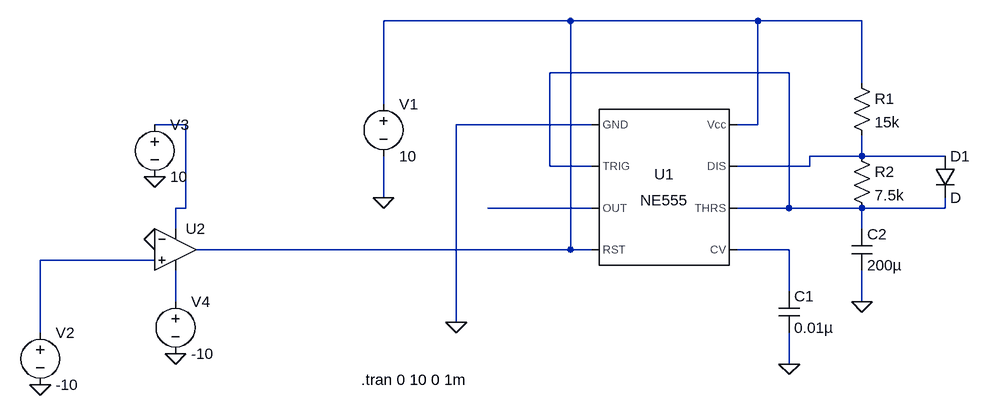
[diagram p0: schematic progetto.asc]
progetto.asc, the LTspice schematic file:
Version 4
SHEET 1 880 680
WIRE 144 -208 -144 -208
WIRE 432 -208 144 -208
WIRE 592 -208 432 -208
WIRE 480 -128 112 -128
WIRE 592 -112 592 -208
WIRE -144 -80 -144 -208
WIRE -448 -48 -496 -48
WIRE 176 -48 -32 -48
WIRE 432 -48 432 -208
WIRE 432 -48 400 -48
WIRE 592 0 592 -32
WIRE 592 0 512 0
WIRE 720 0 592 0
WIRE 112 16 112 -128
WIRE 176 16 112 16
WIRE 512 16 512 0
WIRE 512 16 400 16
WIRE -144 64 -144 0
WIRE -448 80 -448 -48
WIRE -448 80 -464 80
WIRE 176 80 16 80
WIRE 480 80 480 -128
WIRE 480 80 400 80
WIRE 592 80 480 80
WIRE 720 80 720 64
WIRE 720 80 592 80
WIRE -464 112 -464 80
WIRE 592 112 592 80
WIRE 144 144 144 -208
WIRE 144 144 -432 144
WIRE 176 144 144 144
WIRE 480 144 400 144
WIRE -496 160 -672 160
WIRE 480 208 480 144
WIRE -464 224 -464 176
WIRE 592 224 592 176
WIRE -32 256 -32 -48
WIRE -672 272 -672 160
WIRE 480 320 480 272
FLAG -32 256 0
FLAG -144 64 0
FLAG 480 320 0
FLAG 592 224 0
FLAG -496 128 0
FLAG -672 352 0
FLAG -464 304 0
FLAG -496 32 0
SYMBOL Misc\\NE555 288 48 R0
SYMATTR InstName U1
SYMBOL voltage -144 -96 R0
WINDOW 123 0 0 Left 0
WINDOW 39 0 0 Left 0
SYMATTR InstName V1
SYMATTR Value 10
SYMBOL cap 464 208 R0
SYMATTR InstName C1
SYMATTR Value 0.01µ
SYMBOL res 576 -16 R0
SYMATTR InstName R2
SYMATTR Value 7.5k
SYMBOL res 576 -128 R0
SYMATTR InstName R1
SYMATTR Value 15k
SYMBOL cap 576 112 R0
SYMATTR InstName C2
SYMATTR Value 200µ
SYMBOL diode 704 0 R0
SYMATTR InstName D1
SYMBOL voltage -672 256 R0
WINDOW 123 0 0 Left 0
WINDOW 39 0 0 Left 0
SYMATTR InstName V2
SYMATTR Value -10
SYMBOL OpAmps\\UniversalOpAmp -464 144 R0
SYMATTR InstName U2
SYMBOL voltage -496 -64 R0
WINDOW 123 0 0 Left 0
WINDOW 39 0 0 Left 0
SYMATTR InstName V3
SYMATTR Value 10
SYMBOL voltage -464 208 R0
WINDOW 123 0 0 Left 0
WINDOW 39 0 0 Left 0
SYMATTR InstName V4
SYMATTR Value -10
TEXT -178 344 Left 2 !.tran 0 10 0 1m

The netlist it stands for:
* progetto.asc
XU1 0 N002 N005 N001 N006 N002 N004 N001 NE555  ; pins GND TRIG OUT RST CV THRS DIS Vcc
V1 N001 0 10
C1 N006 0 0.01µ
R2 N004 N002 7.5k
R1 N001 N004 15k
C2 N002 0 200µ
D1 N004 N002 D
V2 N007 0 -10
XU2 N007 0 N003 N008 N001 level1 Avol=1Meg GBW=10Meg Vos=0 En=0 Enk=0 In=0 Ink=0 Rin=500Meg  ; pins In+ In- V+ V- OUT
V3 N003 0 10
V4 N008 0 -10
.model D D
.lib standard.dio
.tran 0 10 0 1m
.lib NE555.sub
.lib UniversalOpAmp1.lib
.backanno
.end